# Altium schematic sheet TicketMonitorSystem.SchDoc
size A3
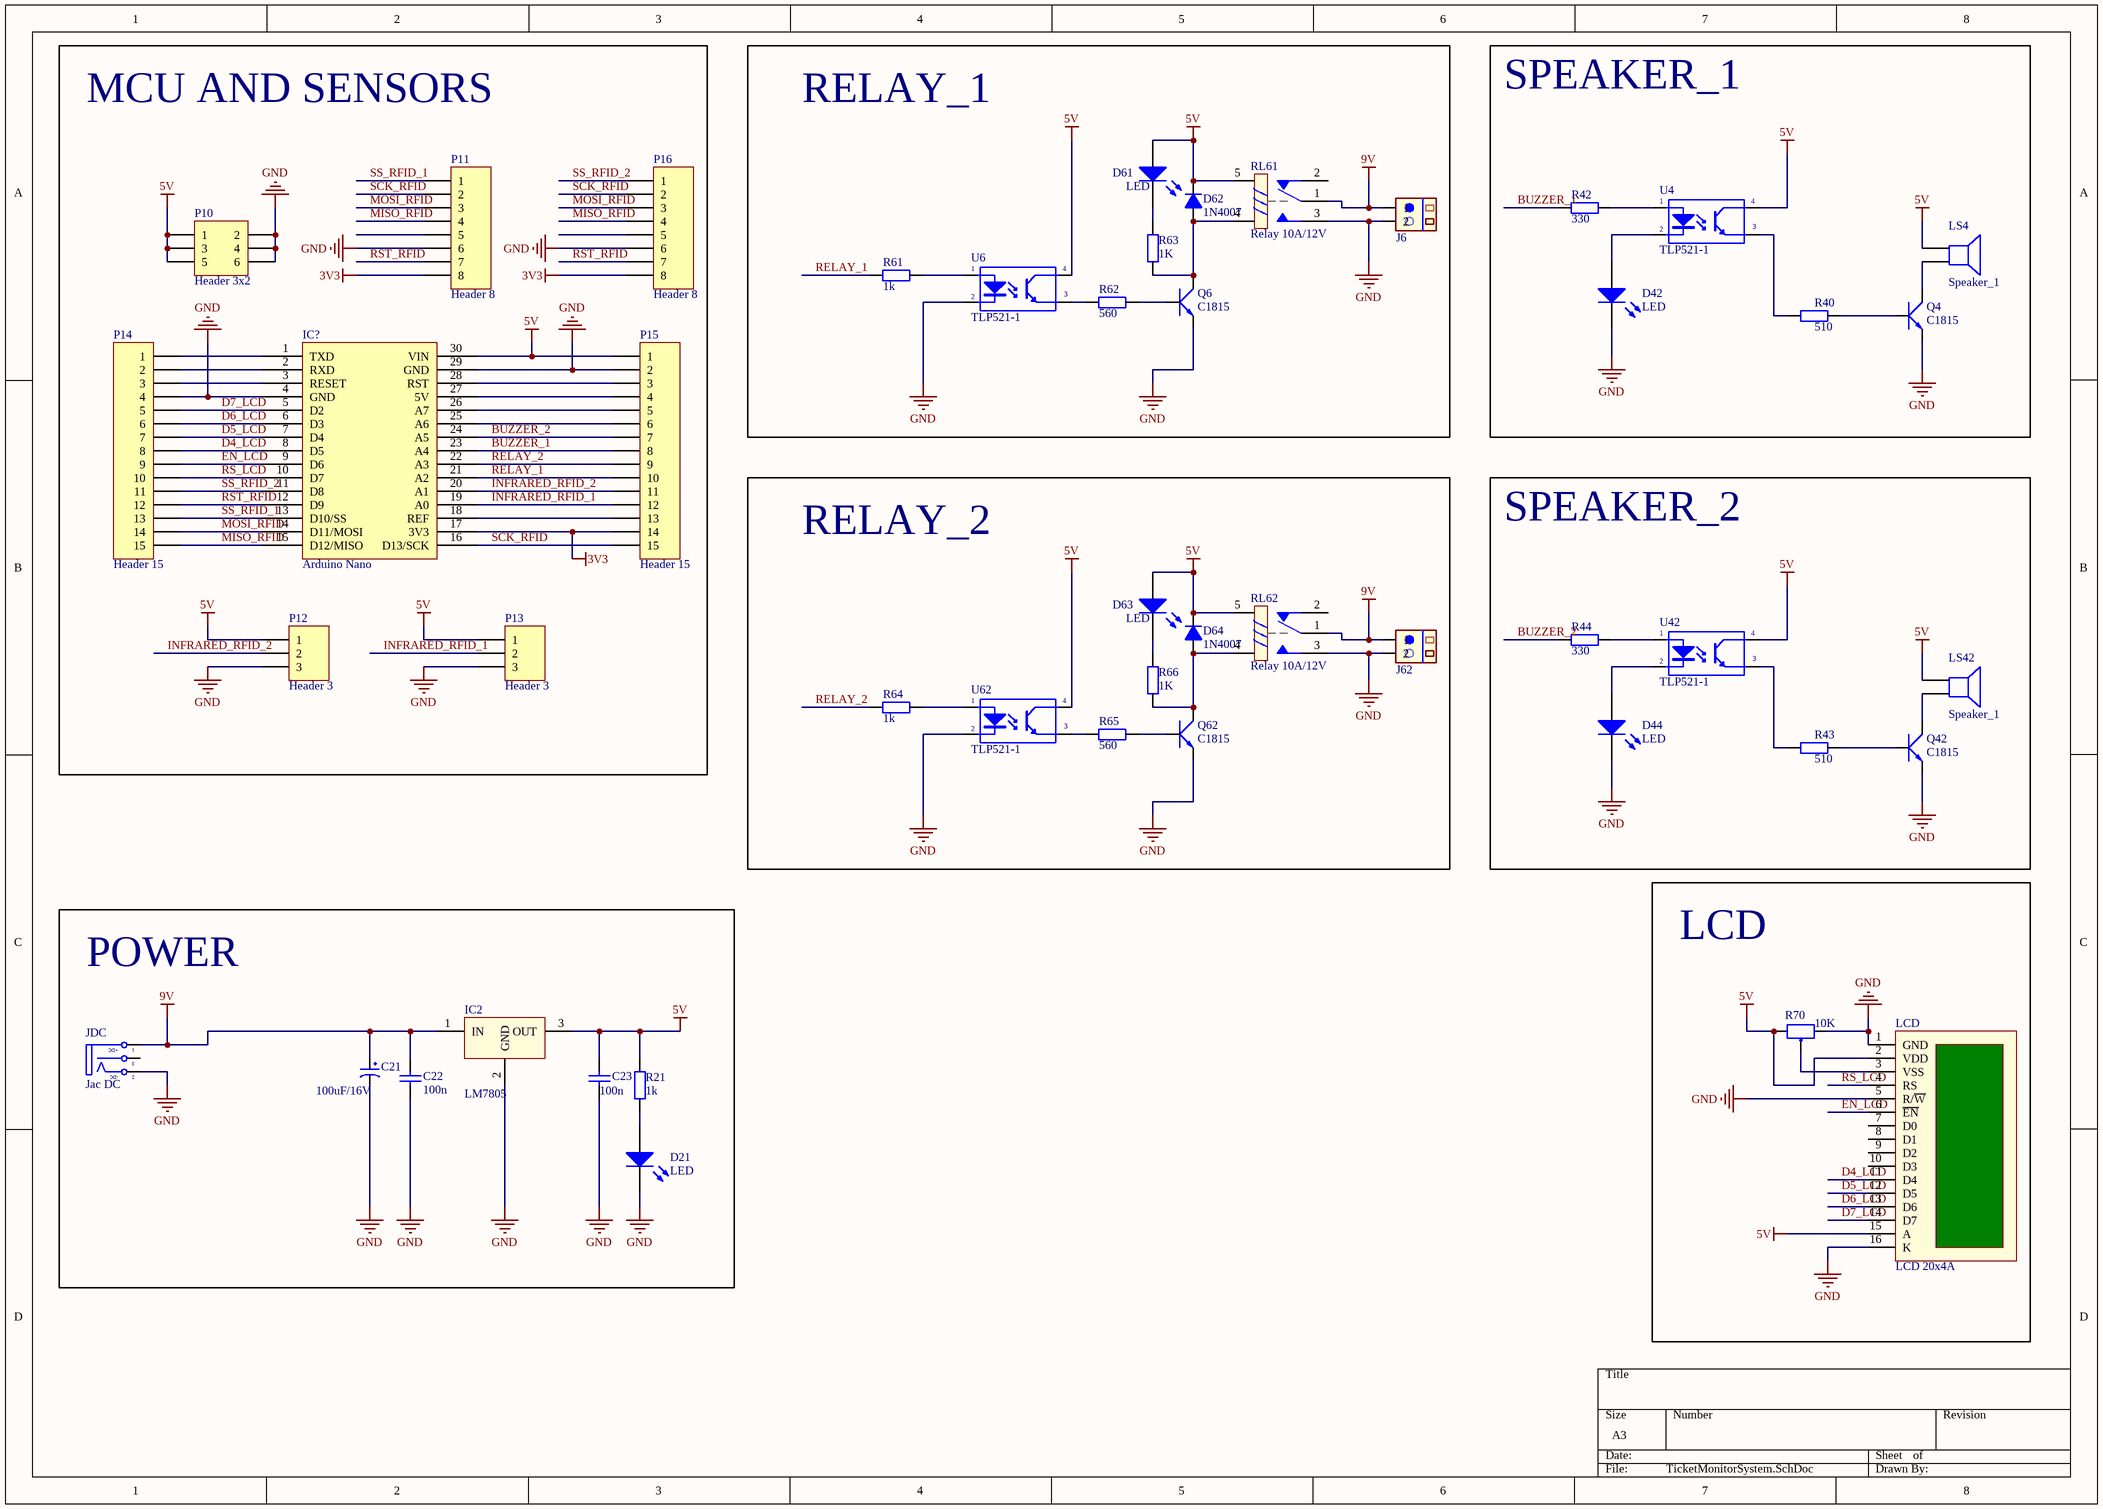
[diagram p0: TicketMonitorSystem.SchDoc]

## Parts
C21  100uF/16V  [CP1/2]
C22  value 100n  [C-NP-0805]  (hidden comment: Cap Non-pol)
C23  value 100n  [C-NP-0805]  (hidden comment: Cap Non-pol)
D21  LED  [LED-0805 RED]
D42  LED  [LED-0805 RED]
D44  LED  [LED-0805 RED]
D61  LED  [LED-0805 RED]
D62  1N4007  [D1A]
D63  LED  [LED-0805 RED]
D64  1N4007  [D1A]
IC2  LM7805  [QTO-220]
IC?  Arduino Nano  [Nano]
J6  CON.Domino2  [Domino 2M]  (value not drawn)
J62  CON.Domino2  [Domino 2M]  (value not drawn)
JDC  Jac DC  [DC-IN]
LCD  LCD 20x4A  [LCD20X4A]
LS4  Speaker_1  [SPEAKER]
LS42  Speaker_1  [SPEAKER]
P10  Header 3x2  [Header 3x2]
P11  Header 8  [Header 8]
P12  Header 3  [Header 3]
P13  Header 3  [Header 3]
P14  Header 15  [HDR1X15]
P15  Header 15  [HDR1X15]
P16  Header 8  [Header 8]
Q4  C1815  [QTO-92]
Q6  C1815  [QTO-92]
Q42  C1815  [QTO-92]
Q62  C1815  [QTO-92]
R21  value 1k  [DIEN TRO 0805]  (hidden comment: RES_SMD_0805)
R40  value 510  [DIEN TRO 0805]  (hidden comment: RES_SMD_0805)
R42  value 330  [DIEN TRO 0805]  (hidden comment: RES_SMD_0805)
R43  value 510  [DIEN TRO 0805]  (hidden comment: RES_SMD_0805)
R44  value 330  [DIEN TRO 0805]  (hidden comment: RES_SMD_0805)
R61  value 1k  [DIEN TRO 0805]  (hidden comment: RES_SMD_0805)
R62  value 560  [DIEN TRO 0805]  (hidden comment: RES_SMD_0805)
R63  value 1K  [DIEN TRO 0805]  (hidden comment: RES_SMD_0805)
R64  value 1k  [DIEN TRO 0805]  (hidden comment: RES_SMD_0805)
R65  value 560  [DIEN TRO 0805]  (hidden comment: RES_SMD_0805)
R66  value 1K  [DIEN TRO 0805]  (hidden comment: RES_SMD_0805)
R70  10K  [VR]
RL61  Relay 10A/12V  [RL_SPDT_10A]
RL62  Relay 10A/12V  [RL_SPDT_10A]
U4  TLP521-1  [DIP4/W0.3]
U6  TLP521-1  [DIP4/W0.3]
U42  TLP521-1  [DIP4/W0.3]
U62  TLP521-1  [DIP4/W0.3]

## Blocks framed on the sheet
MCU AND SENSORS: IC? P10-P16
RELAY_1: D61 D62 J6 Q6 R61-R63 RL61 U6
SPEAKER_1: D42 LS4 Q4 R40 R42 U4
RELAY_2: D63 D64 J62 Q62 R64-R66 RL62 U62
SPEAKER_2: D44 LS42 Q42 R43 R44 U42
LCD: LCD R70
POWER: C21-C23 D21 IC2 JDC R21

## Nets
3V3: IC?.17(3V3) P11.8 P15.14 P16.8
5V: C23.2 D61.1(A) D62.2(K) D63.1(A) D64.2(K) IC2.3(OUT) IC?.30(VIN) LCD.2(VDD) LCD.15(A) LS4.1 LS42.1 P10.1 P10.3 P10.5 P12.1 P13.1 P15.1 R21.2 R70.3 RL61.5 RL62.5 U4.4(C) U6.4(C) U42.4(C) U62.4(C)
9V: C21.1 C22.2 IC2.1(IN) J6.1 J62.1 JDC.1(T) RL61.1 RL62.1
GND: C21.2 C22.1 C23.1 D21.2(K) D42.2(K) D44.2(K) IC2.2(GND) IC?.4(GND) IC?.29(GND) J6.2 J62.2 JDC.2(TN) LCD.1(GND) LCD.5(R/~{W}) LCD.16(K) P10.2 P10.4 P10.6 P11.6 P12.3 P13.3 P14.4 P15.2 P16.6 Q4.1(E) Q6.1(E) Q42.1(E) Q62.1(E) R70.1 RL61.3 RL62.3 U6.2(K) U62.2(K)
BUZZER_1: IC?.23(A4) P15.8 R42.2
BUZZER_2: IC?.24(A5) P15.7 R44.2
D4_LCD: IC?.8(D5) LCD.11(D4) P14.8
D5_LCD: IC?.7(D4) LCD.12(D5) P14.7
D6_LCD: IC?.6(D3) LCD.13(D6) P14.6
D7_LCD: IC?.5(D2) LCD.14(D7) P14.5
EN_LCD: IC?.9(D6) LCD.6(~{EN}) P14.9
INFRARED_RFID_1: IC?.19(A0) P13.2 P15.12
INFRARED_RFID_2: IC?.20(A1) P12.2 P15.11
MISO_RFID: IC?.15(D12/MISO) P11.4 P14.15 P16.4
MOSI_RFID: IC?.14(D11/MOSI) P11.3 P14.14 P16.3
RELAY_1: IC?.21(A2) P15.10 R61.2
RELAY_2: IC?.22(A3) P15.9 R64.2
RS_LCD: IC?.10(D7) LCD.4(RS) P14.10
RST_RFID: IC?.12(D9) P11.7 P14.12 P16.7
SCK_RFID: IC?.16(D13/SCK) P11.2 P15.15 P16.2
SS_RFID_1: IC?.13(D10/SS) P11.1 P14.13
SS_RFID_2: IC?.11(D8) P14.11 P16.1
NetD21_1: D21.1(A) R21.1
NetD42_1: D42.1(A) U4.2(K)
NetD44_1: D44.1(A) U42.2(K)
NetD61_2: D61.2(K) R63.1
NetD62_1: D62.1(A) Q6.2(C) R63.2 RL61.4
NetD63_2: D63.2(K) R66.1
NetD64_1: D64.1(A) Q62.2(C) R66.2 RL62.4
NetIC?_1: IC?.1(TXD) P14.1
NetIC?_2: IC?.2(RXD) P14.2
NetIC?_3: IC?.3(RESET) P14.3
NetIC?_18: IC?.18(REF) P15.13
NetIC?_25: IC?.25(A6) P15.6
NetIC?_26: IC?.26(A7) P15.5
NetIC?_27: IC?.27(5V) P15.4
NetIC?_28: IC?.28(RST) P15.3
NetLCD_3: LCD.3(VSS) R70.2
NetLS4_2: LS4.2 Q4.2(C)
NetLS42_2: LS42.2 Q42.2(C)
NetQ4_3: Q4.3(B) R40.2
NetQ6_3: Q6.3(B) R62.1
NetQ42_3: Q42.3(B) R43.2
NetQ62_3: Q62.3(B) R65.1
NetR40_1: R40.1 U4.3(E)
NetR42_1: R42.1 U4.1(A)
NetR43_1: R43.1 U42.3(E)
NetR44_1: R44.1 U42.1(A)
NetR61_1: R61.1 U6.1(A)
NetR62_2: R62.2 U6.3(E)
NetR64_1: R64.1 U62.1(A)
NetR65_2: R65.2 U62.3(E)

Not connected (* = marked no-connect by the designer): JDC 3(S); LCD 7(D0) 8(D1) 9(D2) 10(D3); P11 5; P16 5; RL61 2; RL62 2

## Notes on the sheet
- (in symbol DCIN) +DC; -DC

## Library data of the parts
C21 = CP1: Cap P  0,1uF < 22uF , 16 - 50V; Value: 10uF/50V; Description 1: 10 => 220uF/6,3V/10V - 10uF => 100uF/16V; Description 2: 0,1uF => 33uF/50V - 10uF => 22uF/63V; Description 3: 0,47uF => 10uF/100V
C22 C23 = Cap Non-pol: Non-polarized Capacitor; Published: 8-Jun-2000; LatestRevisionDate: 17-Jul-2002; LatestRevisionNote: Re-released for DXP Platform.; PackageReference: RAD-0.3; Publisher: Altium Limited
D21 D42 D44 D61 D63 = LED: Typical LED; Published: 8-Jun-2000; LatestRevisionDate: 08-Jul-2005; LatestRevisionNote: Mech Layer 1 removed.; PackageReference: LED-1; Publisher: Altium Limited
D62 D64 = D1A: Diode 1A; Value: 1N4007
IC2 = LM78xx: On ap +, from + 5 to + 24VDC; Value: LM7805
J6 J62 = CON.Domino2: 2 pins Domino Header; Publisher: Hoang Nguyen; ComponentLink1Description: Digikey Part link; ComponentLink2Description: Open DataSheet; ComponentLink2URL: H:\LIBRARY\LIBRARY.Datasheet\; Price: 2000VND
JDC = DCIN: Jac DC input; Value: Jac DC
LCD = LCD20x4A: LCD dipslay 20 char, 4 line; Value: Jum 40; Value: LCD 20x4A
LS4 LS42 = Speaker_1: Loudspeaker; Published: 24-Mar-1999; LatestRevisionDate: 17-Jul-2002; LatestRevisionNote: Re-released for DXP Platform.; PackageReference: PIN2; Publisher: Altium Limited
P10 = Header 3x2: Header, 6-Pin, 2-Row; LatestRevisionDate: 17-Jul-2002; LatestRevisionNote: Re-released for DXP Platform.; Publisher: Altium Limited
P11 P16 = Header 8: Header, 8-Pin; LatestRevisionDate: 17-Jul-2002; LatestRevisionNote: Re-released for DXP Platform.; Publisher: Altium Limited
P12 P13 = Header 3: Header, 3-Pin; LatestRevisionDate: 17-Jul-2002; LatestRevisionNote: Re-released for DXP Platform.; Publisher: Altium Limited
P14 P15 = Header 15: Header, 15-Pin; LatestRevisionDate: 17-Jul-2002; LatestRevisionNote: Re-released for DXP Platform.; Publisher: Altium Limited
Q4 Q6 Q42 Q62 = C1815: NPN 600mW, ECB; Value: C1815
R21 R40 R42-R44 R61-R66 = RES_SMD_0805: RES_0805; Published: 8-Jun-2000; LatestRevisionDate: 17-Jul-2002; LatestRevisionNote: Re-released for DXP Platform.; PackageReference: AXIAL-0.4; Publisher: Altium Limited
R70 = VR: Var Resistor; Value: VR 10K
RL61 RL62 = Relay 1: Relay SPDT,10A - 12VDC 5 Pin; Value: Relay SPDT, 10A, 12V
U4 U6 U42 U62 = TLP521-1: Single Opto; Value: TLP5211